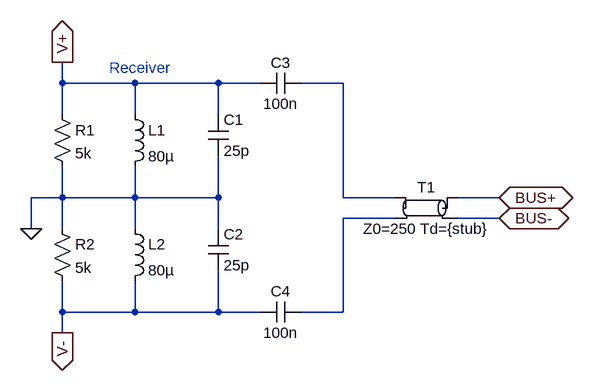
[diagram p0: schematic Receiver.asc]
Receiver.asc, the LTspice schematic file:
Version 4
SHEET 1 880 680
WIRE -32 -176 -32 -208
WIRE 80 -176 -32 -176
WIRE 208 -176 80 -176
WIRE 272 -176 208 -176
WIRE 400 -176 336 -176
WIRE -32 -128 -32 -176
WIRE 80 -128 80 -176
WIRE 208 -128 208 -176
WIRE -32 0 -32 -48
WIRE -32 0 -80 0
WIRE 80 0 80 -48
WIRE 80 0 -32 0
WIRE 208 0 208 -64
WIRE 208 0 80 0
WIRE 400 0 400 -176
WIRE 480 0 400 0
WIRE 640 0 576 0
WIRE 480 32 400 32
WIRE 640 32 576 32
WIRE -80 48 -80 0
WIRE -32 48 -32 0
WIRE 80 48 80 0
WIRE 208 48 208 0
WIRE -32 176 -32 128
WIRE 80 176 80 128
WIRE 80 176 -32 176
WIRE 208 176 208 112
WIRE 208 176 80 176
WIRE 272 176 208 176
WIRE 400 176 400 32
WIRE 400 176 336 176
WIRE -32 208 -32 176
FLAG 640 32 BUS-
IOPIN 640 32 BiDir
FLAG 640 0 BUS+
IOPIN 640 0 BiDir
FLAG -80 48 0
FLAG -32 -208 V+
IOPIN -32 -208 Out
FLAG -32 208 V-
IOPIN -32 208 Out
SYMBOL res -48 -144 R0
SYMATTR InstName R1
SYMATTR Value 5k
SYMBOL res -48 32 R0
SYMATTR InstName R2
SYMATTR Value 5k
SYMBOL cap 192 -128 R0
SYMATTR InstName C1
SYMATTR Value 25p
SYMBOL cap 192 48 R0
SYMATTR InstName C2
SYMATTR Value 25p
SYMBOL cap 272 -192 M90
WINDOW 0 0 32 VBottom 2
WINDOW 3 32 32 VTop 2
SYMATTR InstName C3
SYMATTR Value 100n
SYMBOL cap 272 160 M90
WINDOW 0 0 32 VBottom 2
WINDOW 3 32 32 VTop 2
SYMATTR InstName C4
SYMATTR Value 100n
SYMBOL tline 528 16 M0
SYMATTR InstName T1
SYMATTR Value Z0=250 Td={stub}
SYMBOL ind 64 -144 R0
SYMATTR InstName L1
SYMATTR Value 80µ
SYMBOL ind 64 32 R0
SYMATTR InstName L2
SYMATTR Value 80µ
TEXT 40 -200 Left 2 ;Receiver

The netlist it stands for:
* Receiver.asc
R1 V+ 0 5k
R2 0 V- 5k
C1 V+ 0 25p
C2 0 V- 25p
C3 V+ N001 100n
C4 V- N002 100n
T1 BUS+ BUS- N001 N002 Z0=250 Td={stub}
L1 V+ 0 80µ
L2 0 V- 80µ
* Receiver
.backanno
.end